# Altium schematic sheet Power.SchDoc: Power
size A4
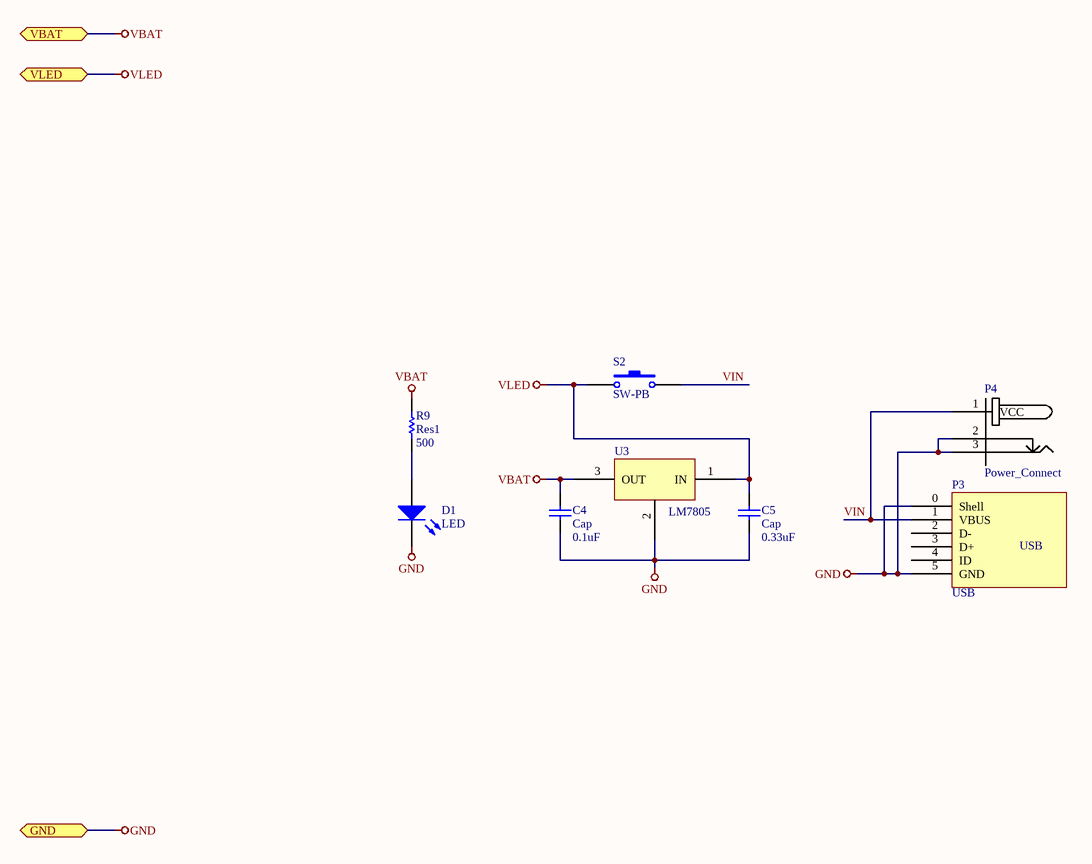
[diagram p0: Power.SchDoc]

## Parts
C4  Cap  value 0.1uF  [C0805]
C5  Cap  value 0.33uF  [C0805]
D1  LED  [L0805R]
P3  USB  [USB-MINI]
P4  Power_Connect  [DC_002]
R9  Res1  value 500  [R0805]
S2  SW-PB  [SW7X7]
U3  LM7805  [TO-263]

## Ports
GND, VBAT, VLED

## Nets
GND: C4.1 C5.1 D1.2(K) P3.0(Shell) P3.5(GND) P4.2(TAP) P4.3(GND) U3.2(GND) ; port GND
VBAT: C4.2 R9.2 U3.3(OUT) ; port VBAT
VLED: C5.2 S2.1 U3.1(IN) ; port VLED
VIN: P3.1(VBUS) P4.1(VCC) S2.2
NetD1_1: D1.1(A) R9.1

Not connected (* = marked no-connect by the designer): P3 2(D-) 3(D+) 4(ID)

## Library data of the parts
C4 C5 = Cap: Non-Polar Capacitor
D1 = LED: Typical INFRARED GaAs LED; Published: 8-Jun-2000; LatestRevisionDate: 08-Jul-2005; LatestRevisionNote: Mech Layer 1 removed.; PackageReference: LED-0; Publisher: Altium Limited; PackageDescription: LED; 2 Leads
P3 = USBPort
P4 = Power: pin to pad: 1>2 2>3 3>1
R9 = Res1: Resistor
S2 = SW-PB: Switch